# EAGLE board INNO_CAN_V1.1 (EAGLE 7.7.0)
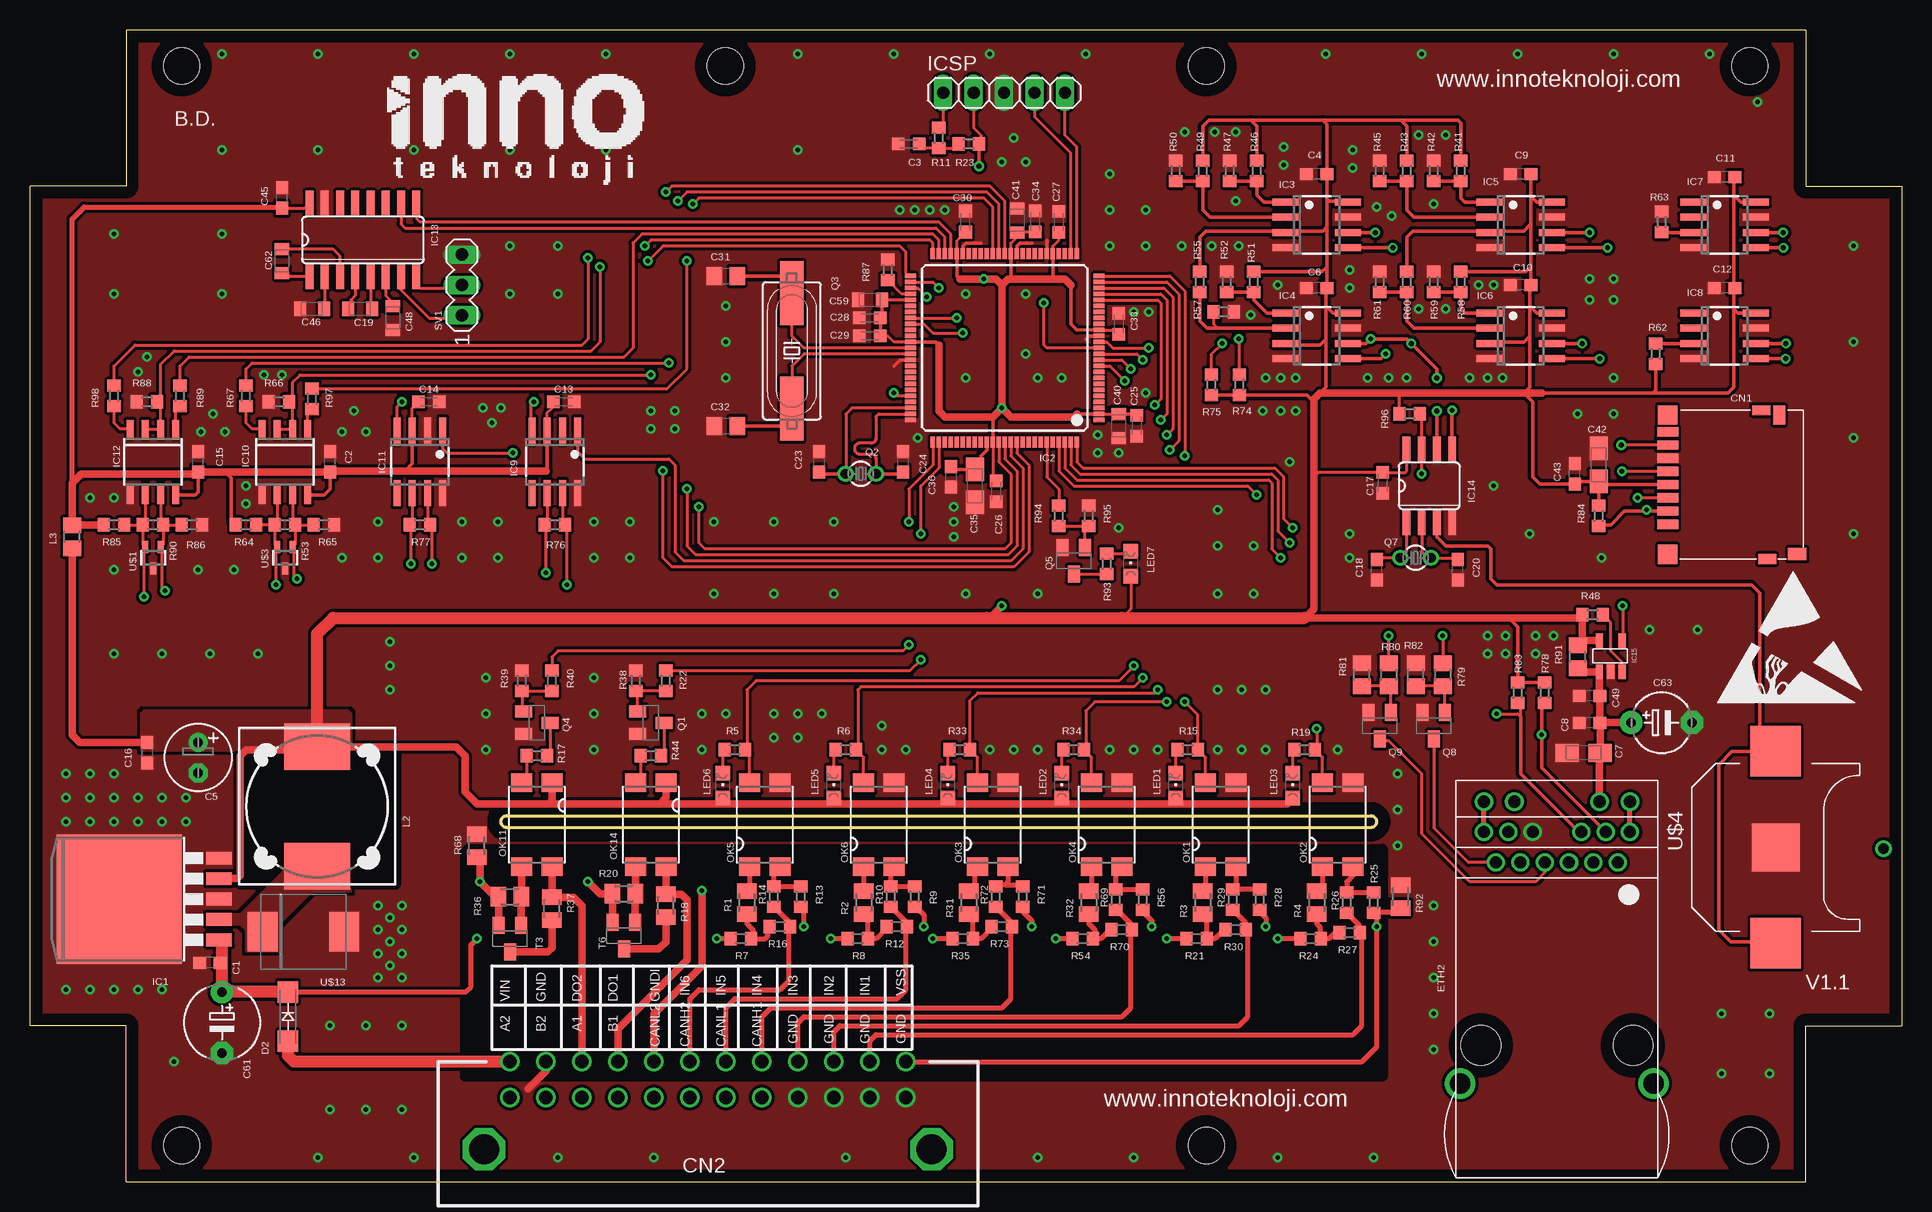
[diagram p8: board, top side]
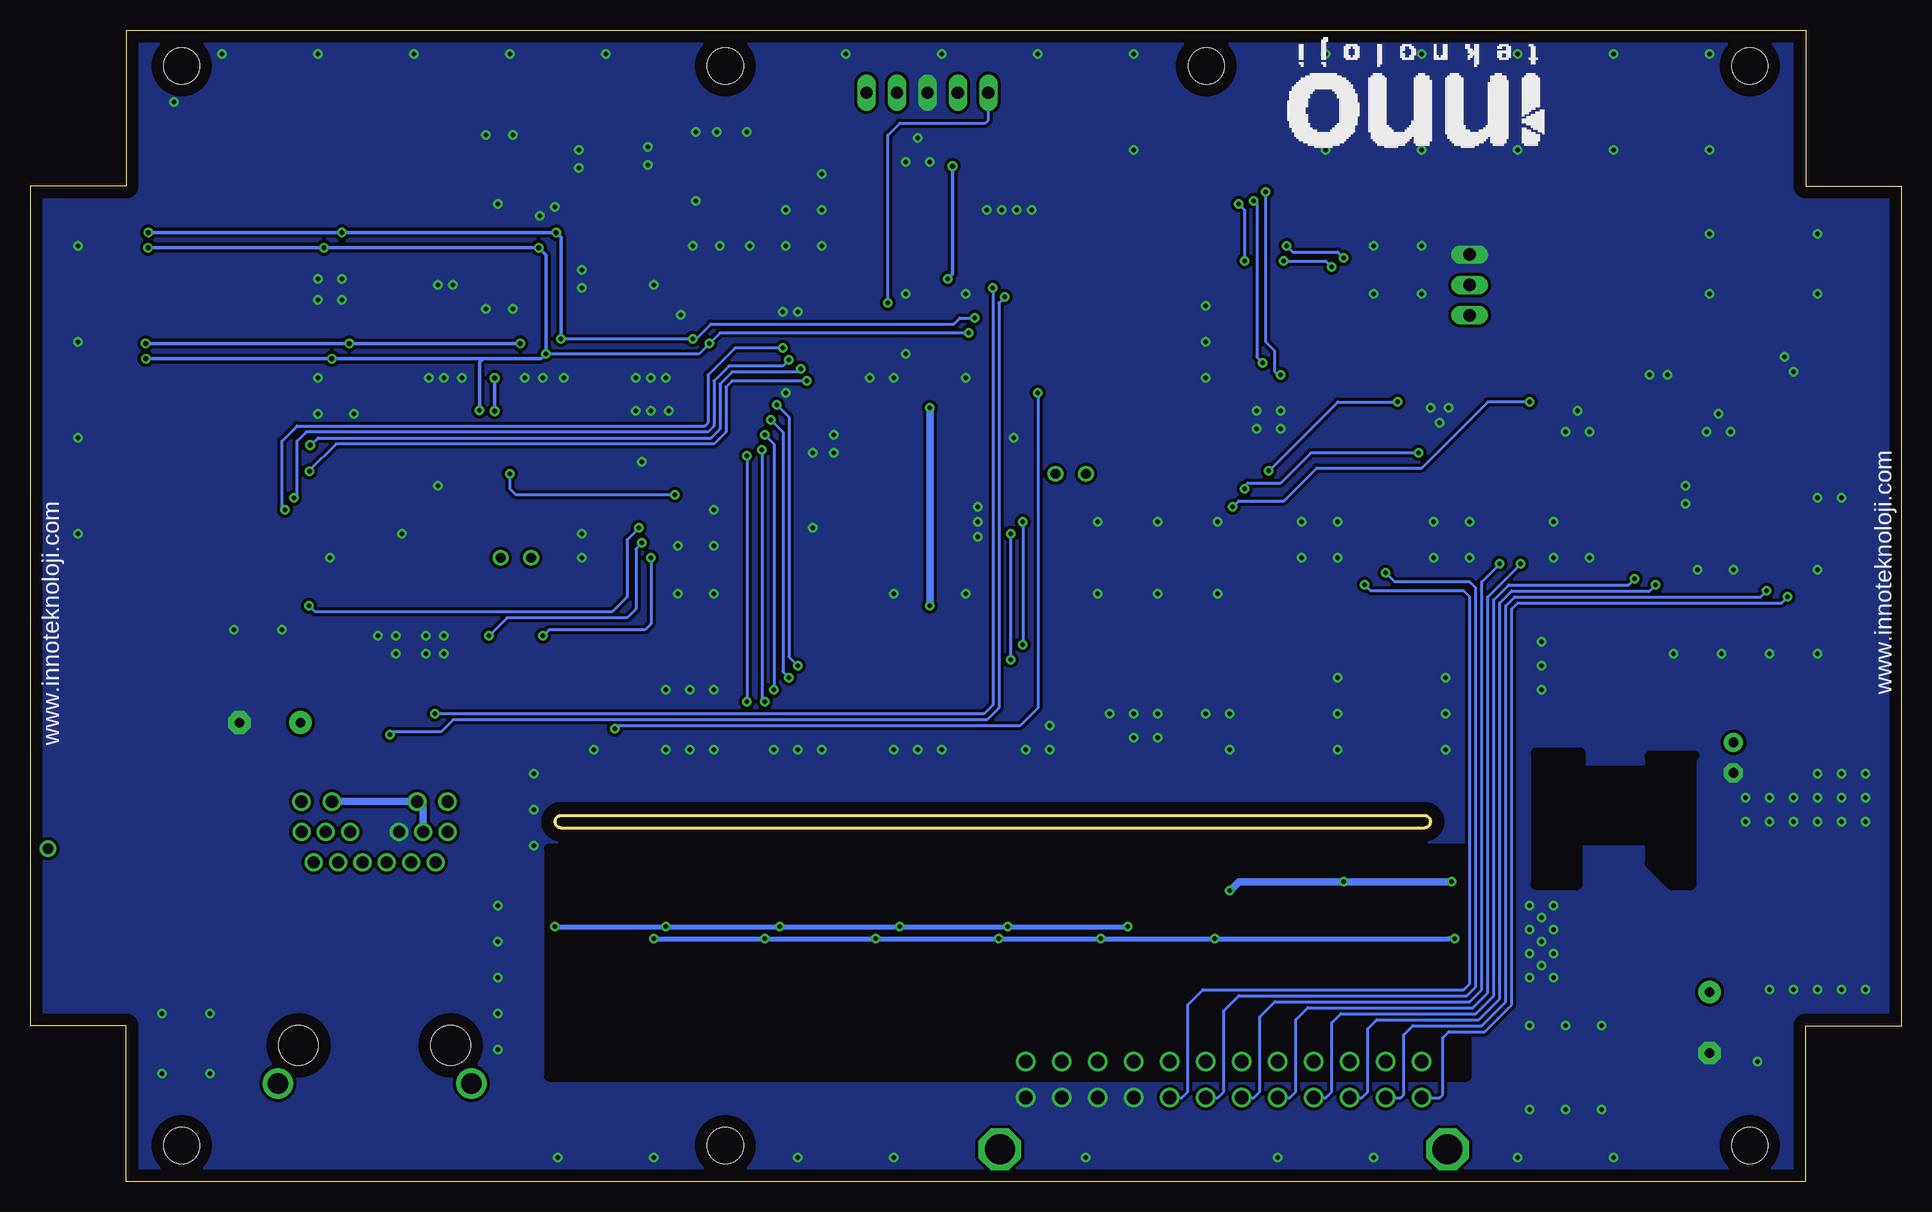
[diagram p9: board, bottom side, seen from below]

Size 156 x 96 mm. Coordinates in mm from the lower left corner, seen from the top.
Outline: 8,0 148,0 148,13 156,13 156,83 148,83 148,96 8,96 8,83 0,83 0,13 8,13 8,0
Outline: 39.75,30.5 111.75,30.5 arc-180 111.75,29.5 39.75,29.5 arc-180 39.75,30.5
Copper layers (1*16): Top 0.035mm / dielectric 1.5mm / Bottom 0.035mm
Design rules "default": minimum track width 10mil, minimum drill 24mil, track to track 8mil, track to pad 8mil, pad to pad 8mil, via to via 8mil, smd to smd 8mil, copper to edge 40mil, drill to drill 8mil, minimum pad ring 10mil, minimum via ring 8mil, stop-mask expansion 4mil, vias tented up to drill 0mil, thermal gap 10mil
Holes 3 mm at 12.65,3 12.65,93 57.95,93 98.05,93 143.35,93 98.05,3 143.35,3
tRestrict: area 36.2,8.8 to 112.8,27.8; area 17.2,24.8 to 30.5,35.8
bRestrict: area 36.2,8.8 to 112.8,27.8; area 17.2,24.8 to 30.5,35.8
Milling: area 39.2,29.5 to 112.2,30.5

## Footprints (pad centres in the part's own frame; a part is rotated, then mirrored left to right if it is on the bottom)
C0603 = smd 1.1 x 1: 1 -0.85,0; 2 0.85,0
C0603K = smd 1.05 x 1.08: 1 -0.875,0; 2 0.875,0
E2,5-6 = drill 0.813 pad 1.6: + -1.27,0 | drill 0.813 pad 1.6 octagon: - 1.27,0
A/3216-18R = smd 1.95 x 1.5: + 1.375,0; - -1.375,0
SMC_Z = smd 1 x 1.2: + -1,0; - 1,0
C0805 = smd 1.3 x 1.5: 1 -0.95,0; 2 0.95,0
E5-6 = drill 0.813 pad 1.905: + -2.54,0 | drill 0.813 pad 1.905 octagon: - 2.54,0
E5-5 = drill 0.813 pad 1.905: + -2.54,0 | drill 0.813 pad 1.905 octagon: - 2.54,0
AMPHENOL_MICROSD = smd 0.78 x 1.75: P$1 3.7,-5; P$2 2.6,-5; P$3 1.5,-5; P$4 0.4,-5; P$5 -0.7,-5; P$6 -1.8,-5; P$7 -2.9,-5; P$8 -4,-5 | smd 1.6 x 1.6: P$9 -5.4,-5; P$10 6.2,-5 | smd 0.8 x 1.5: P$11 -5.8,2.8; P$12 6.6,3.3 | smd 1.55 x 1: SW1 -5.4,4.3 | smd 1 x 1.55: SW2 6.2,5.8
3003-12 = drill 1.1: P$1 -18,0; P$2 -15,0; P$3 -12,0; P$4 -9,0; P$5 -6,0; P$6 -3,0; P$7 0,0; P$8 3,0; P$9 6,0; P$10 9,0; P$11 12,0; P$12 15,0; P$13 -18,-3; P$14 -15,-3; P$15 -12,-3; P$16 -9,-3; P$17 -6,-3; P$18 -3,-3; P$19 0,-3; P$20 3,-3; P$21 6,-3; P$22 9,-3; P$23 12,-3; P$24 15,-3 | drill 2.5 octagon: P$25 -20.16,4.32; P$26 17.16,4.32
SMA-DO214AC = smd 1.8 x 1.7: A -2.05,0; K 2.05,0
USR-K2 = drill 1: P$1 -8.89,5.08; P$2 -8.89,3.05; P$3 -8.89,1.02; P$4 -8.89,-1.01; P$5 -8.89,-3.04; P$6 -8.89,-5.07; P$7 -11.43,6.1; P$8 -11.43,4.07; P$9 -11.43,2.04; P$10 -11.43,-2.02; P$11 -11.43,-4.05; P$12 -11.43,-6.08 | drill 1.03: P$13 -13.97,6.1; P$14 -13.97,3.56; P$15 -13.97,-3.54; P$16 -13.97,-6.08 | drill 1.7: P$17 9.53,8.065; P$18 9.53,-8.055 | hole 3.3: 6.35,6.35; 6.35,-6.34
TO263-5 = smd 1.067 x 2.159: 1 -3.404,-5.791; 2 -1.702,-5.791; 3 0,-5.791; 4 1.702,-5.791; 5 3.404,-5.791 | smd 10.8 x 10.41: 6 0,2.54
TQFP100-14X14 = smd 0.9 x 0.34: 1 -7.85,6; 2 -7.85,5.5; 3 -7.85,5; 4 -7.85,4.5; 5 -7.85,4; 6 -7.85,3.5; 7 -7.85,3; 8 -7.85,2.5; 9 -7.85,2; 10 -7.85,1.5; 11 -7.85,1; 12 -7.85,0.5; 13 -7.85,0; 14 -7.85,-0.5; 15 -7.85,-1; 16 -7.85,-1.5; 17 -7.85,-2; 18 -7.85,-2.5; 19 -7.85,-3; 20 -7.85,-3.5; 21 -7.85,-4; 22 -7.85,-4.5; 23 -7.85,-5; 24 -7.85,-5.5; 25 -7.85,-6; 51 7.85,-6; 52 7.85,-5.5; 53 7.85,-5; 54 7.85,-4.5; 55 7.85,-4; 56 7.85,-3.5; 57 7.85,-3; 58 7.85,-2.5; 59 7.85,-2; 60 7.85,-1.5; 61 7.85,-1; 62 7.85,-0.5; 63 7.85,0; 64 7.85,0.5; 65 7.85,1; 66 7.85,1.5; 67 7.85,2; 68 7.85,2.5; 69 7.85,3; 70 7.85,3.5; 71 7.85,4; 72 7.85,4.5; 73 7.85,5; 74 7.85,5.5; 75 7.85,6 | smd 0.34 x 0.9: 26 -6,-7.85; 27 -5.5,-7.85; 28 -5,-7.85; 29 -4.5,-7.85; 30 -4,-7.85; 31 -3.5,-7.85; 32 -3,-7.85; 33 -2.5,-7.85; 34 -2,-7.85; 35 -1.5,-7.85; 36 -1,-7.85; 37 -0.5,-7.85; 38 0,-7.85; 39 0.5,-7.85; 40 1,-7.85; 41 1.5,-7.85; 42 2,-7.85; 43 2.5,-7.85; 44 3,-7.85; 45 3.5,-7.85; 46 4,-7.85; 47 4.5,-7.85; 48 5,-7.85; 49 5.5,-7.85; 50 6,-7.85; 76 6,7.85; 77 5.5,7.85; 78 5,7.85; 79 4.5,7.85; 80 4,7.85; 81 3.5,7.85; 82 3,7.85; 83 2.5,7.85; 84 2,7.85; 85 1.5,7.85; 86 1,7.85; 87 0.5,7.85; 88 0,7.85; 89 -0.5,7.85; 90 -1,7.85; 91 -1.5,7.85; 92 -2,7.85; 93 -2.5,7.85; 94 -3,7.85; 95 -3.5,7.85; 96 -4,7.85; 97 -4.5,7.85; 98 -5,7.85; 99 -5.5,7.85; 100 -6,7.85
SOIC08 = smd 0.6 x 2.2: 1 -1.905,-2.6; 2 -0.635,-2.6; 3 0.635,-2.6; 4 1.905,-2.6; 5 1.905,2.6; 6 0.635,2.6; 7 -0.635,2.6; 8 -1.905,2.6
D_R-PDSO-G8 = smd 0.6 x 1.5: 1 -1.905,-2.75; 2 -0.635,-2.75; 3 0.635,-2.75; 4 1.905,-2.75; 5 1.905,2.75; 6 0.635,2.75; 7 -0.635,2.75; 8 -1.905,2.75
SO16 = smd 0.66 x 2.032: 1 -4.445,-3.073; 2 -3.175,-3.073; 3 -1.905,-3.073; 4 -0.635,-3.073; 5 0.635,-3.073; 6 1.905,-3.073; 7 3.175,-3.073; 8 4.445,-3.073; 9 4.445,3.073; 10 3.175,3.073; 11 1.905,3.073; 12 0.635,3.073; 13 -0.635,3.073; 14 -1.905,3.073; 15 -3.175,3.073; 16 -4.445,3.073
SOIC-8 = smd 2.032 x 0.66: 1 -3.073,1.27; 2 -3.073,0; 3 -3.073,-1.27; 4 -3.073,-2.54; 5 3.073,-2.54; 6 3.073,-1.27; 7 3.073,0; 8 3.073,1.27
SOT23-5L = smd 1.2 x 0.6: P$1 -1.25,0.95; P$2 -1.25,0; P$3 -1.25,-0.95; P$4 1.35,-0.95; P$5 1.35,0.95
1X05 = drill 1.016 long: 1 -5.08,0; 2 -2.54,0; 3 0,0; 4 2.54,0; 5 5.08,0
DR127 = smd 3.85 x 5.5: 1 -4.975,0; 2 4.975,0
R0805 = smd 1.3 x 1.5: 1 -0.95,0; 2 0.95,0
CHIPLED_0805 = smd 1.2 x 1.2: A 0,-1.05; C 0,1.05
SMD4 = smd 1.78 x 1.55: 1 -1.27,-3.5; 2 1.27,-3.5; 3 1.27,3.5; 4 -1.27,3.5
SOT23-BEC = smd 1 x 1.4: B -0.95,-1.1; C 0,1.1; E 0.95,-1.1
TC26V = drill 0.813: 1 -1.27,0; 2 1.27,0
HC49UP = smd 5.334 x 1.93: 1 -4.826,0; 2 4.826,0
M0805 = smd 1.3 x 1.6: 1 -0.95,0; 2 0.95,0
R0603 = smd 1 x 1.1: 1 -0.85,0; 2 0.85,0
MA03-1 = drill 1.016 long: 1 -2.54,0; 2 0,0; 3 2.54,0
SOT323 = smd 0.5 x 1: 1 -0.65,-0.9; 2 0.65,-0.9; 3 0,0.9
BATTERY = smd 4.2 x 4.2: 1 -7.62,0; 3 8.38,0 | smd 4 x 4: 2 0.38,0
SMC = smd 2.5 x 3.3: P$1 -3.62,-0.18; P$2 3.18,-0.18

## Placement (x,y rotation side)
C1  100nF  [C0603]  15,18.25 180 top
C2  100nF  [C0603]  25,60 90 top
C3  100nF  [C0603K]  73.25,86.5 180 top
C4  100nF  [C0603]  107.25,84 180 top
C5  330uF 6.3V  [E2,5-6]  14.01,35.34 270 top
C6  100nF  [C0603]  107.25,74.5 180 top
C7  4.7uF 25V  [A/3216-18R]  129.5,35.75 0 top
C8  100nF  [C0603]  130,38.25 180 top
C9  100nF  [C0603]  124.25,84 180 top
C10  100nF  [C0603]  124.25,74.75 180 top
C11  100nF  [C0603]  141.25,83.75 180 top
C12  100nF  [C0603]  141.25,74.5 180 top
C13  100nF  [C0603K]  44.5,65 180 top
C14  100nF  [C0603K]  33.25,65 180 top
C15  100nF  [C0603]  14,60 90 top
C16  100nF  [C0603]  9.75,35.75 270 top
C17  100nF  [C0603K]  112.75,58.25 270 top
C18  18pF  [C0603]  112.25,51 90 top
C19  1uF 16V  [SMC_Z]  27.5,72.75 0 top
C20  18pF  [C0603]  119,51 90 top
C23  18pF  [C0603]  65.75,60 270 top
C24  18pF  [C0603]  72.75,60 270 top
C25  100nF  [C0603K]  92.25,63 270 top
C26  100nF  [C0603K]  80.54,57.55 270 top
C27  100nF  [C0603K]  85.75,80 90 top
C28  100nF  [C0603K]  70,72 180 top
C29  100nF  [C0603K]  70,70.5 180 top
C30  100nF  [C0603K]  77.96,80.02 90 top
C31  22pF  [C0805]  58,75.5 0 top
C32  22pF  [C0805]  58,63 0 top
C33  100nF  [C0603K]  90.75,71.5 90 top
C34  100nF  [C0603K]  83.79,80.04 90 top
C35  4.7uF 25V  [A/3216-18R]  78.75,58 90 top
C36  100nF  [C0603]  76.75,58.75 270 top
C40  1uF 16V  [SMC_Z]  90.75,63 270 top
C41  1uF 16V  [SMC_Z]  82.28,80.11 90 top
C42  4.7uF 25V  [A/3216-18R]  130.75,59.75 270 top
C43  100nF  [C0603]  128.75,59 90 top
C45  100nF  [C0603]  21,82 90 top
C46  1uF 16V  [SMC_Z]  23.5,72.75 180 top
C48  1uF 16V  [SMC_Z]  30.25,72 270 top
C49  100nF  [C0603]  130,40.5 180 top
C59  1uF 16V  [SMC_Z]  70,73.5 180 top
C61  100uF 35V  [E5-6]  16,13.25 270 top
C62  1uF 16V  [SMC_Z]  21,76.75 90 top
C63  100uF 6V3  [E5-5]  136,38.26 0 top
CN1  AMPHENOL_MICROSD  [AMPHENOL_MICROSD]  141.5,58.5 270 top
CN2  3003-12  [3003-12]  55,7 180 top
D2  1N4007  [SMA-DO214AC]  21.5,13.75 90 top
ETH2  USR-K2  [USR-K2]  127.27,17.71 270 top
IC1  LM2596S-3V3  [TO263-5]  9.96,23.55 90 top
IC2  PIC32MX795F512L-80I/PF  [TQFP100-14X14]  81.25,69.5 180 top
IC3  24FC1025-I/SN  [SOIC08]  107.25,79.75 270 top
IC4  24FC1025-I/SN  [SOIC08]  107.25,70.5 270 top
IC5  24FC1025-I/SN  [SOIC08]  124.25,79.75 270 top
IC6  24FC1025-I/SN  [SOIC08]  124.25,70.5 270 top
IC7  AT24CM02-SSHM-B  [SOIC08]  141.25,79.75 270 top
IC8  AT24CM02-SSHM-B  [SOIC08]  141.25,70.5 270 top
IC9  MCP2551T-E/SN  [SOIC08]  43.75,60 180 top
IC10  MAX3485EESA+T  [D_R-PDSO-G8]  21.25,60 180 top
IC11  MCP2551T-E/SN  [SOIC08]  32.5,60 180 top
IC12  MAX3485EESA+T  [D_R-PDSO-G8]  10.25,60 180 top
IC13  MAX3232CSE  [SO16]  27.75,78.5 0 top
IC14  DS1307  [SOIC-8]  116,58 90 top
IC15  AP22802AW5-7  [SOT23-5L]  131.75,43.75 90 top
ICSP  [1X05]  81.2,90.77 0 top
L2  100uH  [DR127]  23.93,31.27 90 top
L3  BLM21PG221SN1  [R0805]  3.5,53.75 90 top
LED1  [CHIPLED_0805]  95.5,33 0 top
LED2  [CHIPLED_0805]  86,33 0 top
LED3  [CHIPLED_0805]  105.25,33 0 top
LED4  [CHIPLED_0805]  76.5,33 0 top
LED5  [CHIPLED_0805]  67,33 0 top
LED6  [CHIPLED_0805]  57.75,33 0 top
LED7  [CHIPLED_0805]  91.75,51.5 0 top
OK1  TLP185(GB-TPL,SE,T)  [SMD4]  99.25,29.75 0 top
OK2  TLP185(GB-TPL,SE,T)  [SMD4]  109,29.75 0 top
OK3  TLP185(GB-TPL,SE,T)  [SMD4]  80.25,29.75 0 top
OK4  TLP185(GB-TPL,SE,T)  [SMD4]  89.75,29.75 0 top
OK5  TLP185(GB-TPL,SE,T)  [SMD4]  61.25,29.75 0 top
OK6  TLP185(GB-TPL,SE,T)  [SMD4]  70.75,29.75 0 top
OK11  TLP185(GB-TPL,SE,T)  [SMD4]  42.25,29.75 180 top
OK14  TLP185(GB-TPL,SE,T)  [SMD4]  51.75,29.75 180 top
Q1  BC817-16LT1SMD  [SOT23-BEC]  51.75,38.25 270 top
Q2  32.768KHz  [TC26V]  69.25,59 180 top
Q3  [HC49UP]  63.5,69.25 270 top
Q4  BC817-16LT1SMD  [SOT23-BEC]  42.25,38.25 270 top
Q5  BC817-16LT1SMD  [SOT23-BEC]  87,51.75 180 top
Q7  32.768KHz  [TC26V]  115.5,52 180 top
Q8  BC817-16LT1SMD  [SOT23-BEC]  117,38 180 top
Q9  BC817-16LT1SMD  [SOT23-BEC]  112.5,38 180 top
R1  1K2  [M0805]  59.75,23.25 90 top
R2  1K2  [M0805]  69.5,23.25 90 top
R3  1K2  [M0805]  97.75,23.25 90 top
R4  1K2  [M0805]  107.25,23.25 90 top
R5  330R  [R0603]  58.75,36 180 top
R6  330R  [R0603]  68,36 180 top
R7  0R  [R0603]  59.25,20.25 180 top
R8  0R  [R0603]  69,20.25 180 top
R9  0R  [R0603]  73.75,23.75 90 top
R10  0R  [R0603]  71.75,23.75 90 top
R11  1K  [R0603]  75.75,87 270 top
R12  0R  [R0603]  72.25,21.25 180 top
R13  0R  [R0603]  64.25,23.75 90 top
R14  0R  [R0603]  62,23.75 90 top
R15  330R  [R0603]  96.5,36 180 top
R16  0R  [R0603]  62.5,21.25 180 top
R17  470R  [R0603]  42.25,35.5 0 top
R18  10R  [M0805]  53,23 270 top
R19  330R  [R0603]  106.25,36 180 top
R20  100R  [M0805]  49.5,24 180 top
R21  0R  [R0603]  97.25,20.25 180 top
R22  3K3  [R0603]  53,41.75 90 top
R23  10K  [R0603]  78.25,86.5 0 top
R24  0R  [R0603]  106.75,20.25 180 top
R25  0R  [R0603]  112,23.25 90 top
R26  0R  [R0603]  109.75,23.25 90 top
R27  0R  [R0603]  110,20.75 180 top
R28  0R  [R0603]  102.5,23.5 90 top
R29  0R  [R0603]  100.25,23.5 90 top
R30  0R  [R0603]  100.5,21 180 top
R31  1K2  [M0805]  78.25,23.25 90 top
R32  1K2  [M0805]  88.25,23.25 90 top
R33  330R  [R0603]  77.5,36 180 top
R34  330R  [R0603]  87,36 180 top
R35  0R  [R0603]  77.75,20.25 180 top
R36  100R  [M0805]  40,23.75 180 top
R37  10R  [M0805]  43.5,22.75 270 top
R38  47K  [R0603]  50.5,41.75 90 top
R39  47K  [R0603]  41,41.75 90 top
R40  3K3  [R0603]  43.5,41.75 90 top
R41  10K  [R0603]  119.25,84.25 90 top
R42  10K  [R0603]  117,84.25 90 top
R43  10K  [R0603]  114.75,84.25 90 top
R44  470R  [R0603]  51.75,35.5 0 top
R45  10K  [R0603]  112.5,84.25 90 top
R46  10K  [R0603]  102.25,84.25 90 top
R47  10K  [R0603]  100,84.25 90 top
R48  10k  [R0603]  130.25,47.25 180 top
R49  10K  [R0603]  97.75,84.25 90 top
R50  10K  [R0603]  95.5,84.25 90 top
R51  10K  [R0603]  102,75 90 top
R52  10K  [R0603]  99.75,75 90 top
R53  120R  [R0603]  21.25,54.75 180 top
R54  0R  [R0603]  87.75,20.25 180 top
R55  10K  [R0603]  97.5,75 90 top
R56  0R  [R0603]  92.75,23.5 90 top
R57  10K  [R0603]  99.5,72.5 0 top
R58  10K  [R0603]  119.25,75 90 top
R59  10K  [R0603]  117,75 90 top
R60  10K  [R0603]  114.75,75 90 top
R61  10K  [R0603]  112.5,75 90 top
R62  10K  [R0603]  135.5,69 270 top
R63  10K  [R0603]  136,80 90 top
R64  4k7  [R0603]  18,54.75 180 top
R65  4k7  [R0603]  24.5,54.75 180 top
R66  10k  [R0603]  20.75,65 180 top
R67  51R  [R0603]  18,65.5 90 top
R68  0R  [M0805]  37.25,28 270 top
R69  0R  [R0603]  90.5,23.5 90 top
R70  0R  [R0603]  91,21 180 top
R71  0R  [R0603]  82.75,23.75 90 top
R72  0R  [R0603]  80.5,23.75 90 top
R73  0R  [R0603]  81,21.25 180 top
R74  820R  [R0603]  100.8,66.42 270 top
R75  820R  [R0603]  98.47,66.42 270 top
R76  120R  [R0603]  43.75,54.75 180 top
R77  120R  [R0603]  32.5,54.75 180 top
R78  10K  [R0603]  126.25,40.75 90 top
R79  3k3  [R0805]  117.75,42.25 270 top
R80  3k3  [R0805]  113.25,42.25 270 top
R81  47k  [R0805]  111,42.25 90 top
R82  47k  [R0805]  115.5,42.25 90 top
R83  10K  [R0603]  124,40.75 270 top
R84  10K  [R0603]  130.75,55.5 90 top
R85  4k7  [R0603]  7,54.75 180 top
R86  4k7  [R0603]  13.5,54.75 180 top
R87  100K  [R0603]  71.5,76 270 top
R88  10k  [R0603]  9.75,65 180 top
R89  51R  [R0603]  12.5,65.5 90 top
R90  120R  [R0603]  10.25,54.75 180 top
R91  0R  [R0805]  129,43.75 90 top
R92  0R  [M0805]  114.25,23.75 270 top
R93  330R  [R0603]  89.75,51.5 90 top
R94  3K3  [R0603]  85.75,55.5 90 top
R95  47K  [R0603]  88.25,55.5 90 top
R96  10K  [R0603]  115,64 180 top
R97  51R  [R0603]  23.5,65.25 270 top
R98  51R  [R0603]  7,65.5 270 top
SV1  [MA03-1]  36,74.75 90 top
T3  [SOT23-BEC]  40,20.25 180 top
T6  [SOT23-BEC]  49.5,20.5 180 top
U$1  DF3D18FU,LF  [SOT323]  10.25,52 180 top
U$3  DF3D18FU,LF  [SOT323]  21.25,52 180 top
U$4  BATTERY  [BATTERY]  145.5,28.25 270 top
U$13  SK36_R1_00001  [SMC]  23,21 0 top

## Tracks (layer width: path | path; a pad name or v marks a point on that pad's centre or on a via)
0V  (via drill 0.4)
  Top 0.305: IC2.65 72.5,68.5 72,68 | IC2.36 82.25,78 82.5,78.25 83.5,78.25 | IC2.31 84.75,78.5 | IC2.45 77.75,78 78,78.25 79.25,78.25 | IC2.15 88.25,70.5 88,70.25
  Top 0.61: CN2.P$23 43,9.25 41.5,7.75
  other vias: 38,39 38,42 38,36 30,18 30,20 30,22 25,13 28,13 31,13 31,21 31,19 29,19 29,21 29,23 31,23 29,17 31,17 25,6 28,6 31,6 3,16 5,16 7,16 9,16 11,16 3,30 5,30 7,30 9,30 11,30 11,32 9,32 7,32 5,32 3,32 3,34 5,34 7,34 13,32 13,30 30,45 30,43 30,41 7,44 11,44 15,44 19,44 14,51 17,51 7,51 5,57 7,57 18,56.5 18,58 14.25,62.5 16.25,62.5 15.25,64 26,62.5 28,62.5 27,64.25 9,67.5 9.75,68.75 19.5,67.25 21,67.25 37.75,64.5 39.25,64.5 38.5,63.25 51.75,64.25 53.75,64.25 51.75,62.75 53.75,62.75 26,52 29,52 29,55 36,55 36,52 39,52 39,55 47,52 50,52 50,55 47,55 74,62 77,53.75 77,55 77,56.25 125.5,45.5 127,45.5 125.5,44 123,45.5 121.5,45.5 121.5,44 123,44 47,36 47,39 47,42 56,36 56,39 58,39 62,39 64,39 66,39 64,37 62,37 71,38 71,36 73,36 80,36 82,36 84,36 90,36 92,36 94,36 99,36 101,36 103,36 103,41 101,41 99,41 109,36 114,34 114,31 114,28 117,23 117,20 117,17 117,14 117,11 57,49 62,49 67,49 67,55 62,55 57,55 78,49 83,69 84,67 86,67 78,67 78,74 83,74 90,78 93,78 96,78 93,81 90,81 90,84 81,85 83,85 82,87 76.25,81 75,81 73.75,81 72.5,81 92,72.5 93.25,72.5 89,62.25 89,60.75 90.75,60.75 93,65.75 98.5,78 100.75,78 104.5,84.75 104.5,86.25 100.5,87.5 98.75,87.5 96.25,87.5 110.25,84.5 110.25,86 115.75,87.25 118,87.25 112.25,81.25 113.5,80.5 117,81.5 100.5,81.75 104,74.75 110,76 110,74.5 103,67 104.25,67 105.5,67 120,67 121.5,67 122.75,67 130,75.25 130,73.5 132,73.5 132,75.25 115.75,72.75 118,72.75 120.75,74.75 122,74.75 101.75,72.25 7,79 7,74 16,74 16,79 40,74 40,78 44,78 44,74 58,73 58,70 58,67 99,53 99,49 129,64 132,64 132,67 40,94 32,94 24,94 16,94 48,94 64,94 72,94 80,94 88,94 108,94 116,94 124,94 132,94 140,94 144,90 152,78 152,70 152,62 152,54 112,2 40,86 24,86 32,86 16,86 48,86 64,86 104,2 92,2 84,2 68,2 52,2 44,2 32,2 24,2 12,10 84,49 90.75,54.5 114.75,67 113.25,67 111.5,67 102.75,64.25 104.25,64.25 105.5,64.25 139,46 125,54 122,58 131,52 110,54 102,49 102,53 110,52 105,60 99,56 135,46 145,14 141,14 141,9 145,9
  pour Top (isolate 0.254, rank 2, no thermals): 0,83 8,83 8,96 148,96 148,83 156,83 156,13 148,13 148,0 8,0 8,13 0,13
  pour Bottom (isolate 0.254, rank 2, no thermals): 8,0 8,13 0,13 0,83 8,83 8,96 148,96 148,83 156,83 156,13 148,13 148,0
3V3_ETH
  Top 0.61: ETH2.P$14 130.83,35.7 C7.+ 130.88,38.23 C8.1 | C63.+ C8.1 | C8.1 C49.1 130.8,40.55 IC15.P$1 129.3,42.5 R91.1
  Bottom 0.61: ETH2.P$14 ETH2.P$15 123.22,31.17 ETH2.P$11
+3V3  (via drill 0.4)
  Top 0.254: C33.1 90.62,71 IC2.16 87.25,71 | IC2.86 80.25,58.72 | IC2.2 C40.+ | IC2.37 81.75,78.25 82.25,78.75 | C34.1 82.58,79.17 | IC2.55 C59.+ | IC2.62 72,70 71.5,70.5 C29.1 | ICSP.2 78.66,87.84 79.25,87.25 79.25,86.65 R23.2 | IC2.30 85.25,78 85.75,78.5 C27.1 | IC2.46 77.25,78.44 C30.1 | LED7.A 91.75,47.75 91,47 | R96.2 114.15,65.65 114.25,65.75 | IC14.8 114.75,61.05 114.75,59.25 114.62,59.12 C17.1 107.38,59.12 107,58.75
  Top 0.305: C9.1 125.1,82.15 | 125.1,82.15 125.59,81.66 IC5.8 | IC4.8 108.59,72.41 108,73 | 108,73 108,74.4 C6.1 108.1,76.25 | IC6.8 125.59,72.41 125,73 | 125,73 125,74.65 C10.1 125.1,76.25 | IC7.8 142.59,81.66 142,82.25 | 142,82.25 142,83.65 C11.1 | IC8.8 142.34,72.41 142,72.75 | 142,72.75 142,74.4 C12.1 142,74.6 142,82.25 | 108,73 108,70.25 | 108,70.25 107.5,69.75 104.77,69.75 IC4.3 | 125,73 125,70.5 | 125,70.5 124.5,70 121.78,70 IC6.3 | 125.1,82.15 125.1,79.85 | 125.1,79.85 124.5,79.25 121.78,79.25 IC5.3 121.52,79.25 115.25,79.25 114.75,78.75 R60.2 | 108.1,81.9 C4.1 108.1,88.15 107.75,88.5 | 108.1,81.9 108.25,81.75 109.75,81.75 IC3.8 | 108.1,81.9 108.1,79.6 | 108.1,79.6 107.75,79.25 104.78,79.25 IC3.3 104.52,79.25 98,79.25 97.5,78.75 R55.2 | 108.1,79.6 108.1,76.25 | 125.1,79.85 125.1,76.25 | R58.2 124.7,75.85 125.1,76.25 | R51.2 107.7,75.85 108.1,76.25 | 108,70.25 108,66.25 107.5,65.75 | 125,70.5 125,66.25 124.5,65.75 125.25,65 125.25,58.75 125.85,58.15 C43.1 128.97,58.38 130.25,58.38 | 142,72.75 142,66.25 141.5,65.75 135.25,65.75 | 135.25,65.75 126,65.75 | R49.2 97.75,88 98.25,88.5 101.75,88.5 | 101.75,88.5 107.75,88.5 | 107.75,88.5 114.25,88.5 | 114.25,88.5 119,88.5 119.25,88.25 R41.2 | R43.2 114.75,88 114.25,88.5 | R46.2 102.25,88 101.75,88.5 | R62.2 135.5,66 135.25,65.75 | R75.2 R74.2 106.43,65.57 107,65 | CN1.P$4 131.03,58.1 C42.+ 130.25,58.38 | R84.2 130.75,57.88 130.25,58.38 | 80.25,58.72 C26.1 | C40.+ 92.12,64 C25.1 | 82.25,78.75 82.25,78.83 C41.+ 82.58,79.17 | 85.46,79.17 C27.1 | R78.2 R83.1 124,46.25 123.25,47 | C59.+ 71,72.12 C28.1 C29.1 | IC2.2 87.25,64 | IC2.86 80.25,63.5 80,63.75 | IC2.62 75.5,70 75.75,69.75
  Top 0.305: 87.25,71 86.75,71.5 86.75,74.75 | IC2.37 81.75,75.25 | IC2.46 77.25,75.5 77.5,75.25 | IC2.30 85.25,75.5 85,75.25 | R23.2 v79.1,84.65
  Top 0.61: IC1.4 17.25,25.25 17.5,25.5 17.5,35.5 18,36 23.68,36 L2.2 35.51,36.24 36.25,35.5 36.25,32.5 37.25,31.5 43.25,31.5 | 43.25,31.5 52.5,31.5 | 52.5,31.5 57.75,31.5 | 57.75,31.5 67,31.5 | 67,31.5 76.5,31.5 | 76.5,31.5 86,31.5 | 86,31.5 95.5,31.5 | 95.5,31.5 104.8,31.5 LED3.A | LED1.A 95.5,31.5 | LED2.A 86,31.5 | LED4.A 76.5,31.5 | LED5.A 67,31.5 | LED6.A 57.75,31.5 | OK14.1 53.02,32.02 52.5,31.5 | OK11.1 43.52,31.77 43.25,31.5 | C16.1 4.15,36.6 3.5,37.25 L3.1 | 129.4,45.1 R48.2 129.15,47 123.25,47 106.25,47 107,47.75 107,58.75 107,65 107,65.25 107.5,65.75 114.25,65.75 124.5,65.75 126,65.75 | 129.4,45.1 R91.2 | IC15.P$5 129.4,45.1 | 79.75,47 80,47 v81,48 | v81,64.5 81,74.75 | 81,74.75 81.5,75.25 81.75,75.25 85,75.25 86.25,75.25 86.75,74.75 | 81,74.75 80.5,75.25 v79.5,75.25 77.5,75.25 | v81,64.5 80.25,63.75 80,63.75 76.25,63.75 75.75,64.25 75.75,69.75 | v81,64.5 81.75,63.75 87,63.75 87.25,64
  Top 1.016: L2.2 23.93,45.68 25.25,47 79.75,47 91,47 106.25,47
  Bottom 0.305: v79.1,84.65 79.1,75.65 v79.5,75.25
  Bottom 0.61: v81,48 v81,64.5
  pour Top (isolate 0.254, no thermals): 9.5,39.25 9.25,39 9.25,36 26.75,36 26.75,39 26.5,39.25
+12V  (via drill 0.4)
  Top 0.406: R24.2 v104,20.25 | R21.2 v94.75,20.25 | R54.2 v85.5,20.25 | R35.2 v75.25,20.25 | R8.2 v66.75,20.25 | R7.2 v57.25,20.25 | D2.K 36.3,15.8 36.75,16.25 36.75,19.75 v37.25,20.25
  Top 1.016: D2.K C61.+ 16,18.1 | 16,18.1 C1.1 | 16,18.1 16,19.9 IC1.1
  Bottom 0.406: v104,20.25 v94.75,20.25 v85.5,20.25 v75.25,20.25 v66.75,20.25 v57.25,20.25 37.75,20.25 v37.25,20.25
A1  (via drill 0.4)
  Top 0.254: IC10.6 20.61,54.97 R53.2 | R53.2 R64.1 | R53.2 20.4,53.1 U$3.2 20.5,52.8 v20.5,49.75
  Bottom 0.254: CN2.P$10 45,7 44.5,7.5 44.5,12.75 43.75,13.5 35.25,13.5 33.5,15.25 33.5,48.25 32.5,49.25 21,49.25 v20.5,49.75
A2  (via drill 0.4)
  Top 0.254: IC12.6 9.62,54.97 R90.2 | R85.1 R90.2 | R90.2 9.4,53.1 U$1.2 9.5,52.8 v9.5,48.75
  Bottom 0.254: CN2.P$12 38.5,7 38.25,7.25 38.25,12 37.75,12.5 34.75,12.5 32.5,14.75 32.5,47.75 32,48.25 10,48.25 v9.5,48.75
B1  (via drill 0.4)
  Top 0.254: IC10.7 21.89,54.97 R53.1 | R53.1 R65.2 | R53.1 22.1,53.1 U$3.1 22,52.8 22,50.5 v22.25,50.25
  Bottom 0.254: CN2.P$9 48,7 47.5,7.5 47.5,13.25 46.75,14 35.5,14 34,15.5 34,48.5 32.75,49.75 22.75,49.75 v22.25,50.25
B2  (via drill 0.4)
  Top 0.254: IC12.7 10.88,54.97 R90.1 | R90.1 R86.2 | R90.1 11.1,53.1 U$1.1 11,52.8 11,49.5 v11.25,49.25
  Bottom 0.254: CN2.P$11 41.75,7 41.5,7.25 41.5,12.25 40.75,13 35,13 33,15 33,48 32.25,48.75 11.75,48.75 v11.25,49.25
C1RX  (via drill 0.4)
  Top 0.254: IC2.87 80.75,60 81.75,59 81.75,53.25 81.25,52.75 56.25,52.75 55.75,53.25 v55.75,56.25 | IC11.4 30.59,64.59 v31,65
  Bottom 0.254: v55.75,56.25 55.25,56.75 51.5,56.75 48.75,59.5 40,59.5 34.5,65 v31,65
C1TX  (via drill 0.4)
  Top 0.254: IC2.88 81.25,60.25 82.25,59.25 82.25,53 81.5,52.25 55.5,52.25 54.75,53 v54.75,57.75 | IC11.1 34.41,61.09 34.75,60.75 v40.25,60.75
  Bottom 0.254: v40.25,60.75 49.25,60.75 51.75,58.25 54.5,58.25 54.75,58 v54.75,57.75
C2RX  (via drill 0.4)
  Top 0.254: IC2.90 82.25,60.75 83.25,59.75 83.25,52.5 82,51.25 53.5,51.25 52.75,52 v52.75,59.25 | IC9.4 41.84,62.91 41.75,63 41.75,64.75 v42,65
  Bottom 0.254: v52.75,59.25 47,65 v42,65
C2TX
  Top 0.254: IC2.89 81.75,60.5 82.75,59.5 82.75,52.75 81.75,51.75 54.5,51.75 53.75,52.5 53.75,59.75 53.25,60.25 46.25,60.25 45.66,60.84 IC9.1
CANH1  (via drill 0.4)
  Top 0.254: v44.75,49.75 44.75,54.6 R76.1 44.38,54.97 IC9.7
  Bottom 0.254: CN2.P$5 60,7 59.5,7.5 59.5,14.75 58.25,16 36.5,16 36,16.5 36,48.75 36.5,49.25 44.25,49.25 v44.75,49.75
CANH2  (via drill 0.4)
  Top 0.254: v33.5,51.5 33.5,54.6 R77.1 33.13,54.97 IC11.7
  Bottom 0.254: CN2.P$7 54,7 53.5,7.5 53.5,13.75 52.25,15 36,15 35,16 35,50 v33.5,51.5
CANL1  (via drill 0.4)
  Top 0.254: v43,50.75 43,54.65 R76.2 43.12,54.97 IC9.6
  Bottom 0.254: CN2.P$6 57,7 56.5,7.5 56.5,14.25 55.25,15.5 36.25,15.5 35.5,16.25 35.5,49.5 36,50 42.25,50 v43,50.75
CANL2  (via drill 0.4)
  Top 0.254: v31.75,51.5 31.75,54.65 R77.2 31.86,54.97 IC11.6
  Bottom 0.254: CN2.P$8 51,7 50.5,7.5 50.5,13.5 49.5,14.5 35.75,14.5 34.5,15.75 34.5,48.75 v31.75,51.5
DO1
  Top 0.61: OK14.4 53.02,23.97 R18.1 54.3,23.95 54.75,23.5 54.75,18.5 49,12.75 CN2.P$21
DO1_MCU  (via drill 0.4)
  Top 0.254: IC2.77 75.75,59.5 74.25,58 v74.25,54 | R22.2 73.35,42.6 v74.25,43.5
  Bottom 0.254: v74.25,43.5 v74.25,54
DO2
  Top 0.61: OK11.4 43.52,23.72 R37.1 45.3,23.7 46,23 CN2.P$22
DO2_MCU  (via drill 0.4)
  Top 0.254: IC2.76 75.25,59.75 73.25,57.75 v73.25,55 | v73.25,44.75 72.75,44.25 44,44.25 43.5,43.75 R40.2
  Bottom 0.254: v73.25,55 v73.25,44.75
ETH_ENABLE  (via drill 0.4)
  Top 0.254: IC2.100 87.25,60 87.75,59.5 103.75,59.5 104.5,58.75 104.5,55.25 v105.25,54.5 | v132.75,48 132.75,45.15 IC15.P$4
  Bottom 0.254: v132.75,48 132.25,47.5 107.5,47.5 106.25,48.75 106.25,53.5 v105.25,54.5
EX_IN0_UP1
  Top 0.406: R3.1 98.1,21.95 R21.1 98.75,20.25 99.5,21 R30.2
EX_IN0_UP2
  Top 0.406: R31.1 78.6,21.95 R35.1 79.25,20.25 80.15,21.15 R73.2
EX_IN0_UP3
  Top 0.406: R1.1 59.75,21.5 60.25,21 60.25,20.4 R7.1 61.25,20.25 61.5,20.5 61.5,21.1 R16.2
EX_IN1_UP
  Top 0.406: R26.1 110.85,21.3 R27.1 111,20.6 111,13 110.25,12.25 70.5,12.25 70,11.75 CN2.P$14
EX_IN1_UP1
  Top 0.406: R4.1 107.25,21.5 107.5,21.25 107.5,20.35 R24.1 108.25,20.25 108.75,20.75 R27.2
EX_IN1_UP2
  Top 0.406: R32.1 88.25,21.5 88.75,21 88.75,20.4 R54.1 89.25,20.25 90,21 R70.2
EX_IN1_UP3
  Top 0.406: R2.1 69.85,21.95 R8.1 70.5,20.25 71.4,21.15 R12.2
EX_IN2_UP
  Top 0.406: R29.1 101.35,21.55 R30.1 101.5,20.85 101.5,13.75 100.75,13 67.5,13 67,12.5 CN2.P$15
EX_IN3_UP
  Top 0.406: CN2.P$16 64,13.25 64.5,13.75 91,13.75 91.75,14.5 91.75,20.35 R70.1 91.85,21.4 91,22.25 R69.1
EX_IN4_UP
  Top 0.406: CN2.P$17 61,13.75 61.75,14.5 81,14.5 81.75,15.25 81.75,21.15 R73.1 81.85,21.55 R72.1
EX_IN5_UP
  Top 0.406: R10.1 73.1,21.55 R12.1 73,21.15 73,16 72.25,15.25 58.75,15.25 58,14.5 CN2.P$18
EX_IN6_UP
  Top 0.406: R14.1 63.35,21.55 R16.1 63.25,21.15 63.25,16.75 62.5,16 55.75,16 55,15.25 CN2.P$19
FILTERED_SUPPLY
  Top 0.254: C45.1 22.88,81.15 IC13.16 | IC9.3 43.12,64.11 43.5,64.5 43.5,64.88 C13.2 | IC11.3 31.86,64.49 C14.2
  Top 0.305: IC10.8 24.5,57.25 25,57.75 C2.1 | IC11.3 31.86,59.87 31.25,59.25 | IC9.3 43.12,59.37 43,59.25 | C15.1 14,57.5 13.75,57.25 IC12.8 | R64.2 17,54.75 16.75,55 16.75,58.65 16.25,59.15
  Top 0.406: 3.5,58.25 3.5,80.25 4.5,81.25 20.9,81.25 C45.1
  Top 0.61: R85.2 3.55,54.75 L3.2 3.5,58.25 4.25,59 13.85,59 C15.1 16.25,59.15 C2.1 25.4,59.15 25.5,59.25 31.25,59.25 43,59.25
GND1  (via drill 0.4)
  Top 0.61: T3.E R36.2 38.75,23.75 v37.5,25 37.5,26.8 R68.2 | T6.E R20.2 47.5,24 v46.5,25 | v56,24.25 56,18 52,14 CN2.P$20
  Bottom 0.61: v56,24.25 55.25,25 v46.5,25 v37.5,25
IN1  (via drill 0.4)
  Top 0.254: OK2.4 107.73,35.37 R19.1 107.25,36.15 v107.25,37.75 | IC2.71 72.25,65.5 v72,65.75
  Bottom 0.254: v72,65.75 72,39.5 73.5,38 107,38 v107.25,37.75
IN2  (via drill 0.4)
  Top 0.254: OK1.4 97.98,35.37 R15.1 97.35,38.9 v96.25,40 | IC2.25 95,75.5 96.25,74.25 v96.25,60.5
  Bottom 0.254: v96.25,60.5 v96.25,40
IN3  (via drill 0.4)
  Top 0.254: OK4.4 88.48,35.37 R34.1 88,36.15 88,39.25 88.75,40 v94.75,40 | IC2.24 94.75,75 95.75,74 95.75,61.75 v95,61
  Bottom 0.254: v95,61 95,40.25 v94.75,40
IN4  (via drill 0.4)
  Top 0.254: OK3.4 78.98,35.37 R33.1 78.35,40.1 79,40.75 93.75,40.75 v94,41 | IC2.23 94.5,74.5 95.25,73.75 95.25,62.75 v94.75,62.25
  Bottom 0.254: v94.75,62.25 94,61.5 v94,41
IN5  (via drill 0.4)
  Top 0.254: OK6.4 69.48,35.37 R6.1 69,36.15 69,41 69.25,41.25 92,41.25 v92.75,42 | IC2.22 94.25,74 94.75,73.5 94.75,64 v94.25,63.5
  Bottom 0.254: v94.25,63.5 93.25,62.5 93.25,42.5 v92.75,42
IN6  (via drill 0.4)
  Top 0.254: OK5.4 59.98,35.62 R5.1 59.75,36.15 59.75,41 60.5,41.75 90.75,41.75 v92,43 | IC2.21 94,73.5 94.25,73.25 94.25,65.25 v93.75,64.75
  Bottom 0.254: v93.75,64.75 92.75,63.75 92.75,43.75 v92,43
MCLR  (via drill 0.4)
  Top 0.254: IC2.13 84.75,69.5 84.5,69.75 v84.5,73.25 | ICSP.1 76.12,88.22 R11.1
  Bottom 0.254: v84.5,73.25 84.5,87.25 83.5,88.25 76.37,88.25 76.12,88.5 ICSP.1
MPF_OUT  (via drill 0.4)
  Top 0.254: R96.1 116,64.1 IC14.7 v116,59 | IC2.97 85.75,59.25 87,58 101.5,58 v102.25,57.25
  Bottom 0.254: v102.25,57.25 115.5,57.25 116,57.75 v116,59
N$1
  Top 0.254: IC13.3 25.84,77.16 25.25,77.75 C62.-
N$2
  Top 0.254: IC13.4 27.11,73.86 26.75,73.5 26.75,73 C19.+
N$3
  Top 0.254: C3.1 74.47,86.15 R11.2 77.05,86.15 R23.1
N$4
  Top 0.254: IC13.2 24.57,72.83 C46.+
N$5
  Top 0.406: OK1.1 97.98,24.43 R3.2
N$6
  Top 0.254: IC13.6 29.66,73.84 30.25,73.25 C48.+
N$7
  Top 0.406: OK5.1 59.98,24.43 R1.2
N$8
  Top 0.406: ETH2.P$12 ETH2.P$16
N$9
  Top 0.406: ETH2.P$7 ETH2.P$13
N$10
  Top 0.406: OK2.1 107.73,24.68 R4.2
N$11
  Top 0.406: OK6.1 69.48,24.22 R2.2
N$12
  Top 0.406: OK2.2 110.27,25.52 109.75,25 R26.2 R25.2
N$13
  Top 0.406: OK6.2 71.75,25.98 R10.2 R9.2
N$14
  Top 0.406: OK5.2 62,25.73 R14.2 R13.2
N$15
  Top 0.406: OK1.2 100.52,24.62 R29.2 R28.2
N$16
  Top 0.254: LED5.C 67,35.85 R6.2
N$17
  Top 0.254: LED6.C 57.75,35.85 R5.2
N$18
  Top 0.254: R17.1 41.4,33.67 OK11.2
N$19
  Top 0.61: T3.C 43.15,19.15 43.5,19.5 R37.2
N$20
  Top 0.61: OK11.3 40.98,23.78 R36.1 T3.B
N$21
  Top 0.254: Q1.C 52.85,35.75 R44.2
N$22
  Top 0.254: Q4.C 43.35,35.75 R17.2
N$23
  Top 0.254: Q1.B 50.65,40.75 R38.1 R22.1
N$24
  Top 0.406: R31.2 78.7,24.2 78.75,24.25 78.75,26.02 OK3.1
N$25
  Top 0.254: Q4.B 41,39.35 R39.1 R40.1
N$26
  Top 0.406: OK4.1 88.48,24.43 R32.2
N$27
  Top 0.305: IC5.1 119.59,81.66 119.25,82 R41.1 R42.1
N$28
  Top 0.254: IC15.P$3 132.7,43.3 131.75,44.25 131.75,46.6 R48.1
N$29
  Top 0.305: IC5.2 115.36,80.39 114.75,81 R43.1 R45.1
N$30
  Top 0.305: IC3.1 102.84,81.66 102.25,82.25 R46.1 R47.1
N$31
  Top 0.305: IC3.2 98.36,80.39 97.75,81 R49.1 R50.1
N$32
  Top 0.254: R57.1 98.65,71.48 99,71.14
  Top 0.305: IC4.2 99,71.14 98.11,71.14 97.5,71.75 R55.1
N$33
  Top 0.305: IC4.1 103.09,72.41 102,73.5 R51.1 R52.1
N$34
  Top 0.254: R93.2 91.55,52.35 LED7.C
N$35
  Top 0.305: IC6.1 119.59,72.41 119.25,72.75 R58.1 R59.1
N$36
  Top 0.305: IC6.2 115.36,71.14 114.75,71.75 R60.1 R61.1
N$37
  Top 0.254: R94.1 R95.1 87.95,54.35 Q5.B
N$38
  Top 0.406: OK4.2 90.5,25.73 R69.2 R56.2
N$39
  Top 0.406: OK3.2 81.52,25.02 81.25,24.75 | 81.25,24.75 80.65,24.75 R72.2 | 81.25,24.75 82.6,24.75 R71.2
N$40
  Top 0.254: LED3.C 105.25,35.85 R19.2
N$41
  Top 0.254: IC2.73 68.5,64.5 68,64 68,59.02
  Top 0.305: 68,59.02 Q2.2 65.9,59 C23.2
N$42
  Top 0.254: LED1.C 95.5,35.85 R15.2
N$43
  Top 0.254: LED2.C 86,35.85 R34.2
N$44
  Top 0.254: LED4.C 76.5,35.85 R33.2
N$45
  Top 0.305: IC8.3 135.51,69.86 R62.1
N$46
  Top 0.305: IC7.3 136.03,79.11 R63.1
N$47
  Top 0.254: Q5.C R93.1
N$48
  Top 0.254: IC13.1 21.32,75.43 C62.+
N$49
  Top 0.254: Q2.1 70.52,60.25 arc90 70.11,60.66 69.14,60.66 arc-90 68.74,61.06 68.74,61.15 arc-90 69.14,61.56 70.11,61.56 arc90 70.52,61.96 70.52,63.77 70.75,64 IC2.74
  Top 0.305: Q2.1 72.6,59 C24.2
N$50
  Top 0.254: IC2.54 72.65,74 R87.2
N$51
  Top 0.254: IC14.1 114.73,52.5 Q7.2 112.4,52 C18.2
N$52
  Top 0.254: IC13.7 30.93,74.33 33.25,72 35.79,72 SV1.1
N$53
  Top 0.254: IC13.8 32.2,74.81 32.5,74.5 35.75,74.5 SV1.2
N$54
  Top 0.254: IC14.2 116,52.5 116.5,52 Q7.1 118.85,52 C20.2
N$55  (via drill 0.9)
  other vias: 154.5,27.75
N$56
  Top 0.254: R44.1 50.9,33.67 OK14.2
N$57
  Top 0.61: T6.C 52.4,19.4 53,20 R18.2
N$58
  Top 0.61: OK14.3 50.48,24.03 R20.1 T6.B
N$59
  Top 0.254: IC13.5 28.39,72.86 C19.-
N$61
  Top 0.254: IC10.1 23.16,64.31 R97.2
N$62
  Top 0.254: IC10.4 18.5,62.75 18,63.25 R67.1
N$63
  Top 0.254: IC12.1 12.15,64.31 R89.1
N$64
  Top 0.254: IC12.4 7.5,62.75 7,63.25 R98.2
N$139
  Top 0.305: U$4.1 144.2,35.87 | 144.2,35.87 141.87,35.87 140.75,34.75 140.75,21 141.75,20 144.37,20 U$4.3 | 144.2,35.87 144.2,49.05 143.5,49.75 122.25,49.75 121.75,50.25 121.75,52.75 121.5,53 118,53 117.27,53.73 IC14.3
N$216
  pour Top (isolate 0.254, no thermals): 14.75,21.5 17.5,21.5 18,21 18,19.25 20.75,19.25 20.75,21.5 23.5,24.25 26.75,24.25 26.75,28.25 21.25,28.25 21.25,26 17.5,22.25 14.75,22.25
OSC1
  Top 0.254: IC2.63 64.5,69.5 63.5,70.5 Q3.1
  Top 0.305: C31.2 62.75,75.5 63.5,74.75 Q3.1
OSC2
  Top 0.254: IC2.64 64.5,69 63.5,68 Q3.2
  Top 0.305: C32.2 63,63 63.25,63.25 63.25,64.17 Q3.2
PGC
  Top 0.254: IC2.26 87.25,86.25 86.25,87.25 86.25,90.74 ICSP.5
PGD
  Top 0.254: IC2.27 86.75,85.75 83.75,88.75 ICSP.4
RELOAD
  Top 0.254: Q8.C 117,29.5 119.9,26.6 ETH2.P$6
RELOAD_UP_IO  (via drill 0.4)
  Top 0.254: IC2.99 86.75,59.75 87.5,59 103.5,59 104,58.5 104,54.25 v105,53.25 | v117.75,45.5 R79.1
  Bottom 0.254: v117.75,45.5 116.25,47 106.25,47 105.5,47.75 105.5,52.75 v105,53.25
RS485_CNTRL_2  (via drill 0.4)
  Top 0.254: IC12.3 IC12.2 10.88,64.72 | 10.88,64.72 R88.1 | 10.88,64.72 10.88,68.14 12,69.25 46.75,69.25 47.5,70 v47.5,76.25 | IC2.51 73.25,75.5 73,75.75 73,77.5 72.5,78 52.75,78 v51.5,76.75
  Bottom 0.254: v51.5,76.75 48,76.75 v47.5,76.25
RS_CNTRL  (via drill 0.4)
  Top 0.254: IC10.3 IC10.2 21.89,64.97 | 21.89,64.97 R66.1 | IC2.38 81.25,81.75 80,83 53.5,83 v53,82.5 | 21.89,64.97 21.89,66.64 22.5,67.25 v51.75,67.25
  Bottom 0.254: v51.75,67.25 52,67.25 52.25,67.5 52.25,69.25 53,70 v53,82.5
RST
  Top 0.254: ETH2.P$4 126.26,25.76 125.5,25 120,25 116,29 116,34 113.25,36.75 112.65,36.75 Q9.C
RST_UP_IO  (via drill 0.4)
  Top 0.254: IC2.98 86.25,59.5 87.25,58.5 103.25,58.5 103.5,58.25 103.5,52.75 v104.25,52 | R80.1 v113.25,45.5
  Bottom 0.254: v113.25,45.5 112.75,46 104.75,46 104.25,46.5 v104.25,52
RX_ETH  (via drill 0.4)
  Top 0.254: IC2.53 74,74.5 v74.75,73.75
  Top 0.305: ETH2.P$8 131.34,29.16 126,34.5 126,35.75 v126,37.25 126,39.65 R78.1
  Bottom 0.254: v74.75,73.75 75.25,73.25 75.25,39.5 76.25,38.5 109,38.5 120.75,38.5 121.75,37.5 125.75,37.5 v126,37.25
SCK2  (via drill 0.4)
  Top 0.254: CN1.P$5 v132.7,59.2 | IC2.10 90,68 v91.25,66.75
  Bottom 0.254: v91.25,66.75 97.5,66.75 98,66.25 98,62.5 99,61.5 130.5,61.5 132.7,59.3 v132.7,59.2
SCL2  (via drill 0.4)
  Top 0.254: IC2.58 v77.25,72 | R74.1 100.8,70.2 v100.75,70.25
  Top 0.305: IC3.6 v112.14,79.11 | v146.13,79.11 IC7.6 | IC5.6 v130,79.11 | v111.75,70.25 111.5,70 | IC4.6 111.36,69.86 v111.75,70.25 | IC6.6 v129.38,69.86 | v146.37,69.86 IC8.6 | v111.75,70.25 114.75,70.25 v115.14,69.86 117.27,67.73 v117.27,66.98 | IC14.6 v117.27,64.23
  Bottom 0.254: v111.75,70.25 v100.75,70.25 100.5,70.25 99.25,71.5 79,71.5 78.5,72 v77.25,72
  Bottom 0.305: v146.13,79.11 v130,79.11 v112.14,79.11 112.11,79.11 111.75,78.75 v111.75,70.25 | v146.37,69.86 v129.38,69.86 v115.14,69.86 | v117.27,64.23 v117.27,66.98
SDA2  (via drill 0.4)
  Top 0.254: IC2.59 74.5,71.5 75.25,70.75 v77.75,70.75 | R75.1 98.47,68.97 v99.38,69.88
  Top 0.305: IC3.5 v113.59,77.84 | v146.16,77.84 IC7.5 | IC5.5 v131.5,77.84 | IC4.5 112.59,68.59 v113,69 | IC6.5 v130.84,68.59 | IC8.5 v146.34,68.59 | IC14.5 v118.54,64.29
  Bottom 0.254: v77.75,70.75 98.5,70.75 v99.38,69.88 100.25,69 v113,69
  Bottom 0.305: v146.16,77.84 v131.5,77.84 v113.59,77.84 113,77.25 v113,69 113.41,68.59 118.25,68.59 | 118.25,68.59 v130.84,68.59 v146.34,68.59 | v118.54,64.29 118.54,68.31 118.25,68.59
SDI2  (via drill 0.4)
  Top 0.254: CN1.P$7 v132.65,61.4 | IC2.11 91,68.5 v91.75,67.75
  Bottom 0.254: v91.75,67.75 92,67.5 97.5,67.5 98.5,66.5 98.5,62.75 99.25,62 132,62 132.6,61.4 v132.65,61.4
SDO2  (via drill 0.4)
  Top 0.254: CN1.P$3 v134,57 | IC2.12 92.25,69 v92.75,68.5
  Bottom 0.254: v92.75,68.5 93.25,68 97.75,68 99,66.75 99,63 99.5,62.5 133,62.5 133.75,61.75 133.75,57.25 v134,57
SS2  (via drill 0.4)
  Top 0.254: IC2.14 89.75,70 90.25,69.5 v93.25,69.5 | 135.15,55.9 134.85,55.9 v134.75,56
  Top 0.305: CN1.P$2 135.15,55.9 132.9,55.9 131.75,54.75 130.85,54.75 R84.1
  Bottom 0.254: v93.25,69.5 97.25,69.5 99.5,67.25 99.5,63.25 99.75,63 133.75,63 135,61.75 135,56.25 v134.75,56
STATUS
  Top 0.254: IC2.95 84.75,58.75 85.75,57.75 R94.2
TX_ETH  (via drill 0.4)
  Top 0.254: IC2.52 75.25,75 v75.75,74.5 | 124.25,39.65 124.25,38.75 124,39 v122.25,39
  Top 0.305: ETH2.P$9 129.11,29.14 124.25,34 124.25,38.75 | 124.25,39.65 R83.2
  Bottom 0.254: v75.75,74.5 75.75,39.75 76.5,39 108.5,39 v122.25,39
TXD2
  Top 0.254: Q8.B 117.95,41.1 R79.2 R82.1
TXD3
  Top 0.254: Q9.B 113.45,41.1 R80.2 R81.1
U2RX
  Top 0.254: IC2.49 75.75,78.5 75.25,79 51,79 50.25,78.25 50.25,69.5 49.5,68.75 13.25,68.75 12.5,68 R89.2
U2TX  (via drill 0.4)
  Top 0.254: IC2.50 75.25,78.25 75,78.5 51.75,78.5 v51.25,78 | R98.1 7,68 8.75,69.75 46,69.75 46.5,70.25 v46.5,77
  Bottom 0.254: v51.25,78 50.75,77.5 47,77.5 v46.5,77
U4RX
  Top 0.254: IC2.47 76.75,79 75.75,80 32.5,80 32.25,80.25 32.25,81.52 IC13.9
U4TX
  Top 0.254: IC2.48 76.25,78.75 75.5,79.5 31.25,79.5 30.93,79.83 IC13.10
U5RX  (via drill 0.4)
  Top 0.254: IC2.40 80.25,81.25 79.5,82 55.75,82 v55.25,81.5 | v54.75,76.75 54.75,67.75 53.1,66.1 R97.1
  Bottom 0.254: v54.75,76.75 54.75,81 v55.25,81.5
U5TX  (via drill 0.4)
  Top 0.254: IC2.39 80.75,81.5 79.75,82.5 54.75,82.5 v54,81.75 | R67.2 18,67.75 18.5,68.25 v53.25,68.25
  Bottom 0.254: v54,81.75 53.75,81.5 53.75,68.75 v53.25,68.25
VCAP
  Top 0.305: IC2.85 79.75,61 79.25,60.5 79.25,59.88 C35.+ 76.97,59.38 C36.1
VIN
  Top 1.016: CN2.P$24 22,10 21.5,10.5 D2.A
VSS  (via drill 0.4)
  Top 0.406: CN2.P$13 111,10 112.25,11.25 v112.25,21.25 112.25,22.15 | 112.25,22.15 R25.1 | v64.5,21.25 64.5,22.65 R13.1 | R9.1 73.85,22.9 74.5,22.25 v74.5,21.25 | R71.1 82.75,22.5 83.5,21.75 v83.5,21.25 | R56.1 92.75,22.5 93.5,21.75 v93.5,21.25 | R28.1 102.5,22.5 103,22 v103,21.25 | 112.25,22.15 112.25,22.5 113.95,22.5 R92.2
  Bottom 0.406: v112.25,21.25 v103,21.25 v93.5,21.25 v83.5,21.25 v74.5,21.25 v64.5,21.25

## Text on the board
tPlace: www.innoteknoloji.com | B.D. | IN6 | IN5 | IN4 | IN3 | IN2 | IN1 | VSS | V1.1 | VIN | GND | DO2 | DO1 | GNDI | A2 | B2 | A1 | B1 | GND | GND | GND | GND | CANL2 | CANH2 | CANL1 | CANH1 | www.innoteknoloji.com
bPlace: www.innoteknoloji.com | www.innoteknoloji.com
tDocu: HH-040